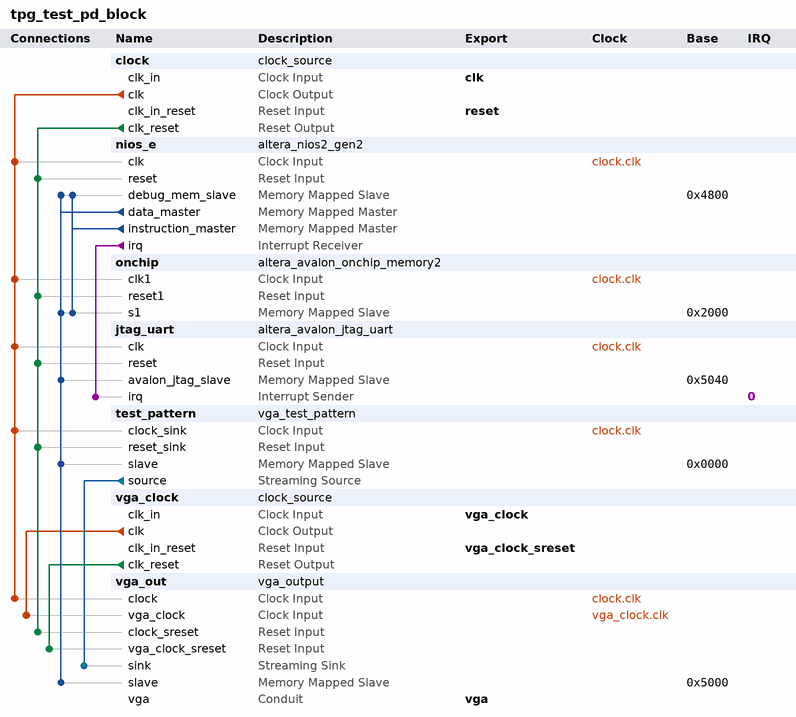
[diagram p0: system contents]
# Platform Designer (Qsys) system tpg_test_pd_block, MAX 10 10M50DAF484C7G
# Parameters at their usual value, and those the tool derives, are not listed.
package require -exact qsys 18.1
create_system tpg_test_pd_block
set_project_property DEVICE_FAMILY {MAX 10}
set_project_property DEVICE 10M50DAF484C7G

add_instance clock clock_source 18.1
set_instance_parameter_value clock clockFrequency 100000000
set_instance_parameter_value clock resetSynchronousEdges BOTH

add_instance nios_e altera_nios2_gen2 18.1
set_instance_parameter_value nios_e dcache_size 2048
set_instance_parameter_value nios_e exceptionSlave onchip.s1
set_instance_parameter_value nios_e icache_size 4096
set_instance_parameter_value nios_e impl Tiny
set_instance_parameter_value nios_e resetSlave onchip.s1

add_instance onchip altera_avalon_onchip_memory2 18.1
set_instance_parameter_value onchip dataWidth 32
set_instance_parameter_value onchip dualPort false
set_instance_parameter_value onchip initMemContent true
set_instance_parameter_value onchip initializationFileName onchip_mem.hex
set_instance_parameter_value onchip memorySize 8192

add_instance jtag_uart altera_avalon_jtag_uart 18.1
set_instance_parameter_value jtag_uart simInteractiveOptions NO_INTERACTIVE_WINDOWS

add_instance test_pattern vga_test_pattern 1.0
set_instance_parameter_value test_pattern WIDTH 16
set_instance_parameter_value test_pattern WIDTHB 5
set_instance_parameter_value test_pattern WIDTHG 6
set_instance_parameter_value test_pattern WIDTHR 5
set_instance_parameter_value test_pattern XRES 640
set_instance_parameter_value test_pattern YRES 480

add_instance vga_clock clock_source 18.1
set_instance_parameter_value vga_clock clockFrequency 50000000
set_instance_parameter_value vga_clock clockFrequencyKnown false
set_instance_parameter_value vga_clock resetSynchronousEdges BOTH

add_instance vga_out vga_output 1.0
set_instance_parameter_value vga_out FIFO_DEPTH 512
set_instance_parameter_value vga_out NO_SIGNAL_RGB 65280
set_instance_parameter_value vga_out VGA_HBPORCH 48
set_instance_parameter_value vga_out VGA_HFPORCH 16
set_instance_parameter_value vga_out VGA_HSYNC 96
set_instance_parameter_value vga_out VGA_VBPORCH 33
set_instance_parameter_value vga_out VGA_VFPORCH 10
set_instance_parameter_value vga_out VGA_VSYNC 2
set_instance_parameter_value vga_out VGA_XRES 640
set_instance_parameter_value vga_out VGA_YRES 480
set_instance_parameter_value vga_out WIDTH 16

# connections
add_connection clock.clk jtag_uart.clk clock
add_connection clock.clk nios_e.clk clock
add_connection clock.clk onchip.clk1 clock
add_connection clock.clk test_pattern.clock_sink clock
add_connection clock.clk vga_out.clock clock
add_connection vga_clock.clk vga_out.vga_clock clock
add_connection clock.clk_reset jtag_uart.reset reset
add_connection clock.clk_reset nios_e.reset reset
add_connection clock.clk_reset onchip.reset1 reset
add_connection clock.clk_reset test_pattern.reset_sink reset
add_connection clock.clk_reset vga_out.clock_sreset reset
add_connection vga_clock.clk_reset vga_out.vga_clock_sreset reset
add_connection nios_e.data_master jtag_uart.avalon_jtag_slave avalon
set_connection_parameter_value nios_e.data_master/jtag_uart.avalon_jtag_slave baseAddress 0x5040
add_connection nios_e.data_master nios_e.debug_mem_slave avalon
set_connection_parameter_value nios_e.data_master/nios_e.debug_mem_slave baseAddress 0x4800
add_connection nios_e.data_master onchip.s1 avalon
set_connection_parameter_value nios_e.data_master/onchip.s1 baseAddress 0x2000
add_connection nios_e.data_master test_pattern.slave avalon
set_connection_parameter_value nios_e.data_master/test_pattern.slave baseAddress 0x0000
add_connection nios_e.data_master vga_out.slave avalon
set_connection_parameter_value nios_e.data_master/vga_out.slave baseAddress 0x5000
add_connection nios_e.instruction_master nios_e.debug_mem_slave avalon
set_connection_parameter_value nios_e.instruction_master/nios_e.debug_mem_slave baseAddress 0x4800
add_connection nios_e.instruction_master onchip.s1 avalon
set_connection_parameter_value nios_e.instruction_master/onchip.s1 baseAddress 0x2000
add_connection test_pattern.source vga_out.sink avalon_streaming
add_connection nios_e.irq jtag_uart.irq interrupt
set_connection_parameter_value nios_e.irq/jtag_uart.irq irqNumber 0

# exported interfaces
add_interface clk clock sink
set_interface_property clk EXPORT_OF clock.clk_in
add_interface reset reset sink
set_interface_property reset EXPORT_OF clock.clk_in_reset
add_interface vga conduit end
set_interface_property vga EXPORT_OF vga_out.vga
add_interface vga_clock clock sink
set_interface_property vga_clock EXPORT_OF vga_clock.clk_in
add_interface vga_clock_sreset reset sink
set_interface_property vga_clock_sreset EXPORT_OF vga_clock.clk_in_reset

set_interconnect_requirement {$system} qsys_mm.clockCrossingAdapter HANDSHAKE
set_interconnect_requirement {$system} qsys_mm.enableEccProtection FALSE
set_interconnect_requirement {$system} qsys_mm.insertDefaultSlave FALSE
set_interconnect_requirement {$system} qsys_mm.maxAdditionalLatency 1

save_system tpg_test_pd_block.qsys
